# Altium schematic sheet US_EPS_RBF.SchDoc
size A4
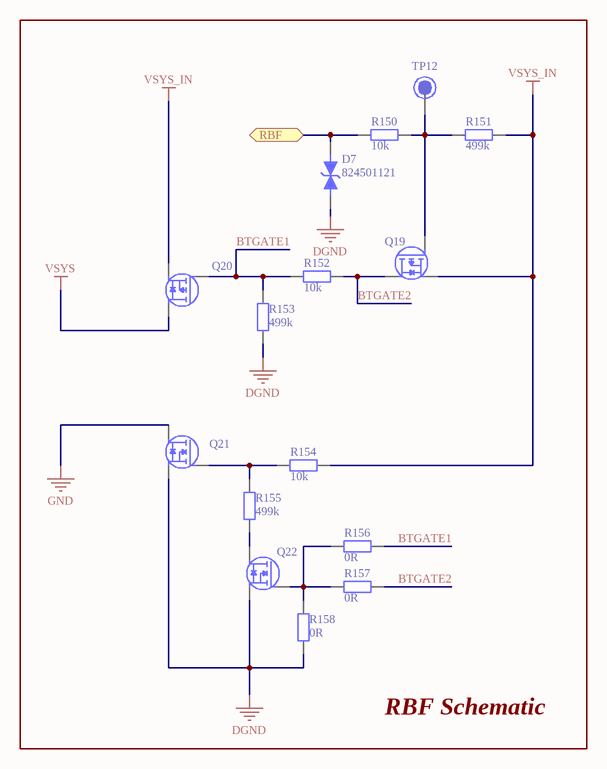
[diagram p0: US_EPS_RBF.SchDoc]

## Parts
D7  824501121  [DIOM4227X25N]
Q19  SISH625DN-T1-GE3  [SISH625DN]  (value not drawn)
Q20  SISH625DN-T1-GE3  [SISH625DN]  (value not drawn)
Q21  SISA14DN-T1-GE3  [SISA14DN]  (value not drawn)
Q22  SISA14DN-T1-GE3  [SISA14DN]  (value not drawn)
R150  10k  [C0603_IPC_HD]
R151  499k  [C0603_IPC_HD]
R152  10k  [C0603_IPC_HD]
R153  499k  [C0603_IPC_HD]
R154  10k  [C0603_IPC_HD]
R155  499k  [C0603_IPC_HD]
R156  0R  [R0603_IPC_MD]
R157  0R  [R0603_IPC_MD]
R158  0R  [R0603_IPC_MD]
TP12  Test Point  [TestPoint_1M5]  (value not drawn)  (no BOM)

## Blocks framed on the sheet
RBF Schematic: D7 Q19-Q22 R150-R158 TP12

## Ports
RBF

## Nets
DGND: D7.1 Q21.1(S) Q22.1(S) R153.1 R158.1
GND: Q21.3(D)
VSYS: Q20.3(D)
VSYS_IN: Q19.1(S) Q20.1(S) R151.1 R154.2
BTGATE1: Q20.2(G) R152.1 R153.2 R156.2
BTGATE2: Q19.3(D) R152.2 R157.2
RBF: D7.2 R150.1 ; port RBF
NetQ19_2: Q19.2(G) R150.2 R151.2 TP12.0
NetQ21_2: Q21.2(G) R154.1 R155.2
NetQ22_2: Q22.2(G) R156.1 R157.1 R158.2
NetQ22_3: Q22.3(D) R155.1

## Library data of the parts
D7 = 824501121_TVS: TVS DIODE 12V 19.9V DO214AC; Manufacturer: Wurth Electronics Inc.; Voltage - Reverse Standoff (Typ): 12V (Max); Current - Average Rectified (Io): 1A; Manufacturer Part Number: 824501121; Supplier 1: Digi-Key; Supplier Part Number 1: 732-9949-1-ND
Q19 Q20 = SISH625DN-T1: P-Channel 30V 17.3A (Ta), 35A (Tc) 3.7W (Ta), 52W (Tc) Surface Mount PowerPAK® 1212-8SH; Manufacturer: Vishay Siliconix; Manufacturer Part Number: SISH625DN-T1-GE3; Supplier 1: Digi-Key; Supplier Part Number 1: SISH625DN-T1-GE3CT-ND
Q21 Q22 = SiSA14DN: N-Channel 30V 20A (Tc) 3.57W (Ta), 26.5W (Tc) Surface Mount PowerPAK® 1212-8; Manufacturer: Vishay Siliconix; Manufacturer Part Number: SISA14DN-T1-GE3; Supplier 1: Digi-Key; Supplier Part Number 1: SISA14DN-T1-GE3CT-ND
R150 R152 R154 = CR0603-JW-10k: RES 10K OHM 1% 1/10W 0603; Manufacturer: Stackpole Electronics Inc; Manufacturer Part Number: RMCF0603FT10K0; Value: 10k; Tolarance: ±1%; Supplier 1: Digi-Key; Supplier Part Number 1: RMCF0603FT10K0CT-ND
R151 R153 R155 = CR0603-JW-499K: RES 499K OHM 1% 1/10W 0603; Manufacturer: Stackpole Electronics Inc; Manufacturer Part Number: RMCF0603FT499K; Value: 499k; Tolarance: ±1%; Supplier 1: Digi-Key; Supplier Part Number 1: RMCF0603FT499KCT-ND
R156-R158 = CR0603-J/-000ELF: RES SMD 0 OHM JUMPER 1/10W 0603; Manufacturer: Bourns Inc.; Tolarance: 1%; Value: 0R; Manufacturer Part Number: CR0603-J/-000ELF; Supplier 1: Digi-Key; Supplier Part Number 1: CR0603-J/-000ELFCT-ND
TP12 = TP